# EAGLE design alfred_comm (EAGLE 7.3.0)
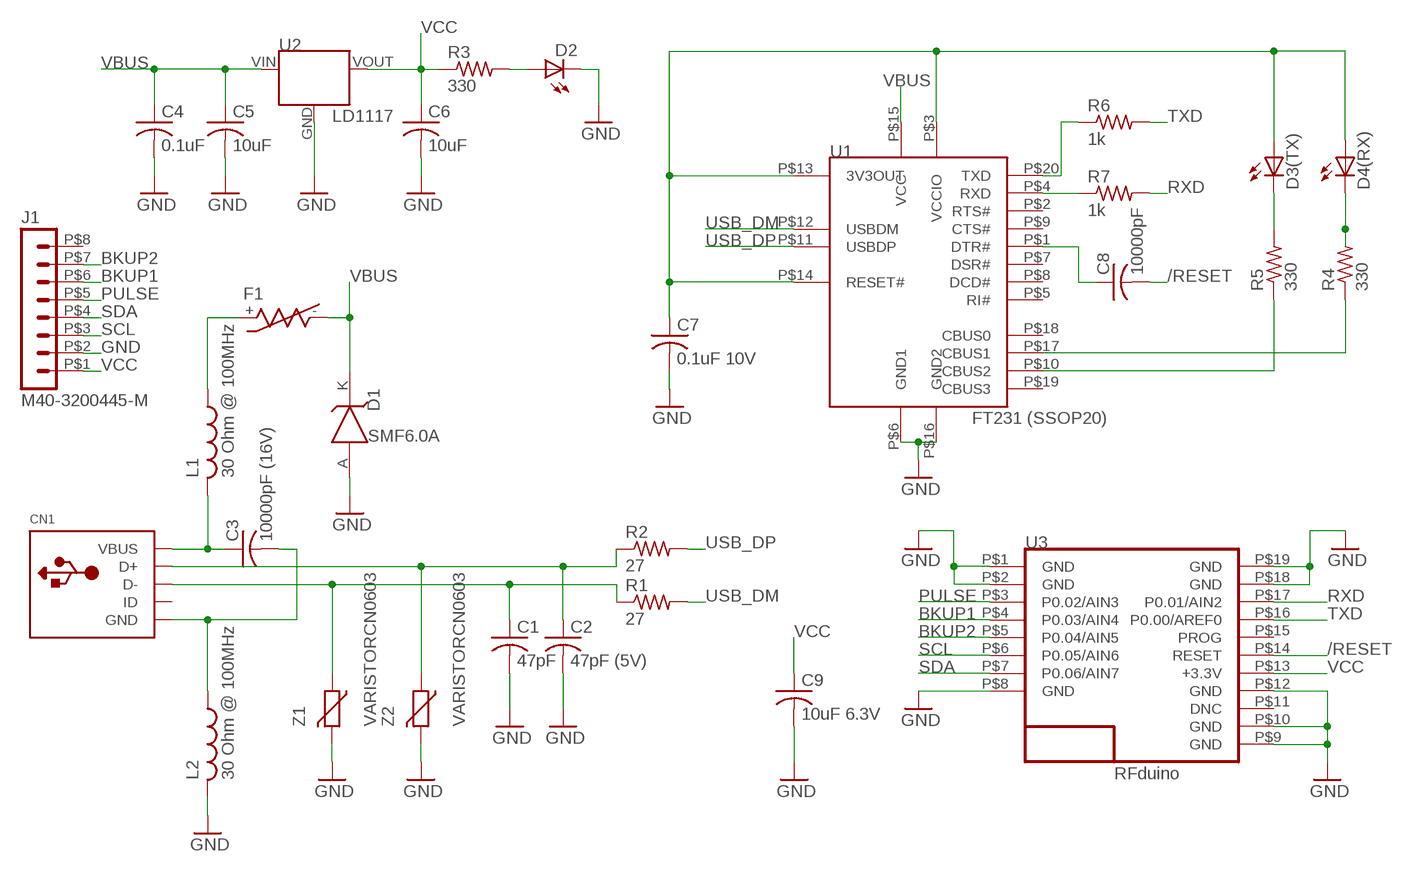
[diagram p0: schematic, sheet 1]

## Parts
C1  47pF  C-USC0603  [C0603]
C2  47pF (5V)  C-USC0603  [C0603]
C3  10000pF (16V)  C-USC0603  [C0603]
C4  0.1uF  C-USC0603  [C0603]
C5  10uF  C-USC0603  [C0603]
C6  10uF  C-USC0603  [C0603]
C7  0.1uF 10V  C-USC0603  [C0603]
C8  10000pF  C-USC0603  [C0603]
C9  10uF 6.3V  C-USC0603  [C0603]
CN1  USBMINIB  [USB-MINIB]
D1  SMF6.0A  [SOD-123F]
D2  LEDCHIPLED_0603  [CHIPLED_0603]
D3(TX)  LEDCHIPLED_0603  [CHIPLED_0603]
D4(RX)  LEDCHIPLED_0603  [CHIPLED_0603]
F1  MF-MSMF050  [BOURNS-STYLE1]
J1  M40-3200445-M  [8-PO-M]
L1  30 Ohm @ 100MHz  L-US0603  [L0603]
L2  30 Ohm @ 100MHz  L-US0603  [L0603]
R1  27  R-US_R0603  [R0603]
R2  27  R-US_R0603  [R0603]
R3  330  R-US_R0603  [R0603]
R4  330  R-US_R0603  [R0603]
R5  330  R-US_R0603  [R0603]
R6  1k  R-US_R0603  [R0603]
R7  1k  R-US_R0603  [R0603]
U1  FT231  [SSOP20]
U2  LD1117-SOT-223  [SOT223]
U3  RFD22301  [RFD21733]
Z1  VARISTORCN0603  [CT/CN0603]
Z2  VARISTORCN0603  [CT/CN0603]

## Nets
/RESET: C8.2 U3.P$14(RESET)
BKUP1: J1.P$6 U3.P$4(P0.03/AIN4)
BKUP2: J1.P$7 U3.P$5(P0.04/AIN5)
GND: C1.2 C2.2 C4.2 C5.2 C6.2 C7.2 C9.2 D1.A D2.C J1.P$2 L2.2 U1.P$6(GND1) U1.P$16(GND2) U2.GND U3.P$1(GND) U3.P$2(GND) U3.P$8(GND) U3.P$9(GND) U3.P$10(GND) U3.P$12(GND) U3.P$18(GND) U3.P$19(GND) Z1.2 Z2.2
N$1: C2.1 CN1.D+ R2.1 Z2.1
N$2: C1.1 CN1.D- R1.1 Z1.1
N$3: C3.1 CN1.VBUS L1.2
N$4: C3.2 CN1.GND L2.1
N$5: F1.+ L1.1
N$6: C7.1 D3(TX).A D4(RX).A U1.P$3(VCCIO) U1.P$13(3V3OUT) U1.P$14(RESET#)
N$7: C8.1 U1.P$1(DTR#)
N$8: R4.1 U1.P$17(CBUS1)
N$9: D3(TX).C R5.2
N$10: D4(RX).C R4.2
N$11: R5.1 U1.P$10(CBUS2)
N$12: R6.1 U1.P$20(TXD)
N$13: R7.1 U1.P$4(RXD)
N$15: D2.A R3.2
PULSE: J1.P$5 U3.P$3(P0.02/AIN3)
RXD: R7.2 U3.P$17(P0.01/AIN2)
SCL: J1.P$3 U3.P$6(P0.05/AIN6)
SDA: J1.P$4 U3.P$7(P0.06/AIN7)
TXD: R6.2 U3.P$16(P0.00/AREF0)
USB_DM: R1.2 U1.P$12(USBDM)
USB_DP: R2.2 U1.P$11(USBDP)
VBUS: C4.1 C5.1 D1.K F1.- U1.P$15(VCC) U2.VIN(IN)
VCC: C6.1 C9.1 J1.P$1 R3.1 U2.VOUT(OUT) U3.P$13(+3.3V)
Unconnected: CN1.ID J1.P$8 U1.P$2(RTS#) U1.P$5(RI#) U1.P$7(DSR#) U1.P$8(DCD#) U1.P$9(CTS#) U1.P$18(CBUS0) U1.P$19(CBUS3) U3.P$11(DNC) U3.P$15(PROG)

## Notes on the sheet
- LD1117
- FT231 (SSOP20)
- SMF6.0A
- RFduino

## Library data of the parts
C1-C9 = rcl:C-US: CAPACITOR, American symbol
CN1 = adafruit:USB: USB Connectors USBMINIB - Surface Mount Female Mini-B USB Connector 4UConnector: 06564 By microbuilder.eu Thru-hole RA Female Mini-B USB Connector 4UConnector: 18732 By ladyada.net
D1 = Zener:SMF6.0A
D2 D3(TX) D4(RX) = adafruit:LED: LED OSRAM: - CHIPLED LG R971, LG N971, LY N971, LG Q971, LY Q971, LO R971, LY R971 LH N974, LH R974 LS Q976, LO Q976, LY Q976 LO Q996 - Hyper CHIPLED LW Q18S LB Q993, LB Q99A, LB R99A - SideLED LS A670, LO A670, LY A670, LG A670, LP A670 LB A673, LV A673, LT A673, LW A673 LH A674 LY A675 LS A676, LA A676, LO A676, LY A676, LW A676 LS A679, LY A679, LG A679 - Hyper Micro SIDELED® LS Y876, LA Y876, LO Y876, LY Y876 LT Y87S - SmartLED LW L88C, LW L88S LB L89C, LB L89S, LG L890 LS L89K, LO L89K, LY L89K LS L896, LA L896, LO L896, LY L896 - TOPLED LS T670, LO T670, LY T670, LG T670, LP T670 LSG T670, LSP T670, LSY T670, LOP T670, LYG T670 LG T671, LOG T671, LSG T671 LB T673, LV T673, LT T673, LW T673 LH T674 LS T676, LA T676, LO T676, LY T676, LB T676, LH T676, LSB T676, LW T676 LB T67C, LV T67C, LT T67C, LS T67K, LO T67K, LY T67K, LW E67C LS E67B, LA E67B, LO E67B, LY E67B, LB E67C, LV E67C, LT E67C LW T67C LS T679, LY T679, LG T679 LS T770, LO T770, LY T770, LG T770, LP T770 LB T773, LV T773, LT T773, LW T773 LH T774 LS E675, LA E675, LY E675, LS T675 LS T776, LA T776, LO T776, LY T776, LB T776 LHGB T686 LT T68C, LB T68C - Hyper Mini TOPLED® LB M676 - Mini TOPLED Santana® LG M470 LS M47K, LO M47K, LY M47K Source: http://www.osram.convergy.de/
F1 = fuse:MF-MSMF050
J1 = board-to-board-conn:M40-3200445-M
L1 L2 = murata-inductors:L-US
R1-R7 = rcl:R-US_: RESISTOR, American symbol
U1 = ftdichip:FT231
U2 = st-microelectronics:LD1117-SOT-223
U3 = RFD22301-11.25.13:RFD22301: RF Digital RFD22301
Z1 Z2 = varistor:VARISTOR: VARISTOR

## Board
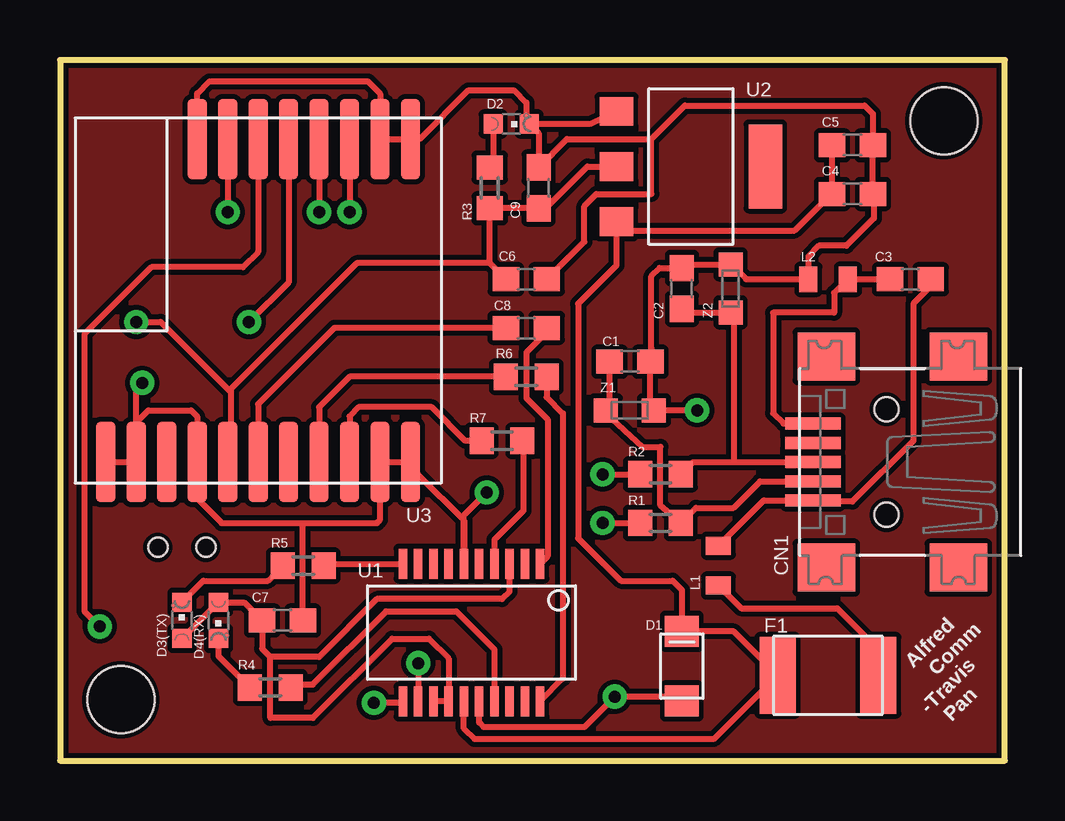
[diagram p1: board, top side]
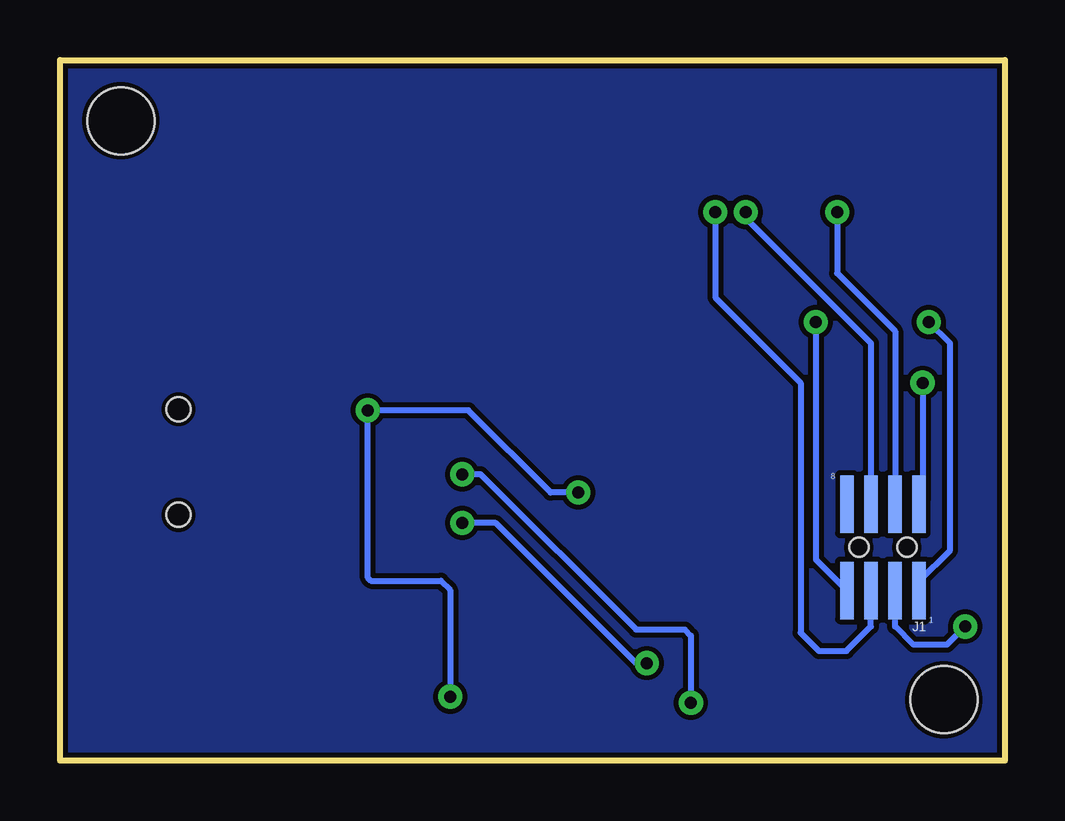
[diagram p2: board, bottom side, seen from below]

Size 39.37 x 29.21 mm. Coordinates in mm from the lower left corner, seen from the top.
Outline: 0,0 39.37,0 39.37,29.21 0,29.21 0,0
Copper layers (1*16): Top 0.035mm / dielectric 1.5mm / Bottom 0.035mm
Design rules "SparkFun": minimum track width 8mil, minimum drill 20mil, track to track 8mil, track to pad 8mil, pad to pad 8mil, via to via 8mil, smd to smd 8mil, copper to edge 8mil, drill to drill 8mil, minimum pad ring 12mil, minimum via ring 10mil, stop-mask expansion 4mil, vias tented up to drill 20mil, thermal gap 10mil
Holes 2.8 mm at 2.54,2.54 36.83,26.67

### Footprints (pad centres in the part's own frame; a part is rotated, then mirrored left to right if it is on the bottom)
C0603 = smd 1.1 x 1: 1 -0.85,0; 2 0.85,0
USB-MINIB = smd 0.5 x 2.308: D+ 0,4.064; D- -0.8,4.064; GND 1.6,4.064; ID 0.8,4.064; VBUS -1.6,4.064 | smd 2 x 2.4: GND1 -4.4,-2; GND2 -4.4,3.5; GND3 4.4,3.5; GND4 4.4,-2 | hole 1: -2.2,1; 2.2,1
SOD-123F = smd 1.3 x 1.4: A 1.45,0; K -1.45,0
CHIPLED_0603 = smd 0.8 x 0.8: A 0,-0.75; C 0,0.75
BOURNS-STYLE1 = smd 1.5 x 3.2: + -2.1,0; - 2.1,0
8-PO-M = smd 0.56 x 2.4: P$1 -1.5,1.8; P$2 -1.5,-1.8; P$3 -0.5,1.8; P$4 -0.5,-1.8; P$5 0.5,1.8; P$6 0.5,-1.8; P$7 1.5,1.8; P$8 1.5,-1.8 | hole 0.8: -1,0; 1,0
L0603 = smd 0.75 x 1.05: 1 -0.825,0; 2 0.825,0
R0603 = smd 1 x 1.1: 1 -0.85,0; 2 0.85,0
SSOP20 = smd 0.36 x 1.25: P$1 -2.857,-2.867; P$2 -2.223,-2.867; P$3 -1.587,-2.867; P$4 -0.953,-2.867; P$5 -0.318,-2.867; P$6 0.318,-2.867; P$7 0.953,-2.867; P$8 1.587,-2.867; P$9 2.223,-2.867; P$10 2.857,-2.867; P$11 2.857,2.867; P$12 2.223,2.867; P$13 1.587,2.867; P$14 0.953,2.867; P$15 0.318,2.867; P$16 -0.318,2.867; P$17 -0.953,2.867; P$18 -1.587,2.867; P$19 -2.223,2.867; P$20 -2.857,2.867
SOT223 = smd 1.2 x 1.4: GND -2.3,-3.1; VIN 2.3,-3.1; VOUT 0,-3.1 | smd 3.5 x 1.4: P$1 0,3.1
RFD21733 = smd 3.353 x 0.813: P$1 -6.731,6.35; P$2 -6.731,5.08; P$3 -6.731,3.81; P$4 -6.731,2.54; P$5 -6.731,1.27; P$6 -6.731,0; P$7 -6.731,-1.27; P$8 -6.731,-2.54; P$9 6.731,-6.35; P$10 6.731,-5.08; P$11 6.731,-3.81; P$12 6.731,-2.54; P$13 6.731,-1.27; P$14 6.731,0; P$15 6.731,1.27; P$16 6.731,2.54; P$17 6.731,3.81; P$18 6.731,5.08; P$19 6.731,6.35
CT/CN0603 = smd 1 x 1: 1 -1,0; 2 1,0

### Placement (x,y rotation side)
C1  23.75,16.64 0 top
C2  25.91,19.68 90 top
C3  35.43,20.07 180 top
C4  33.02,23.62 0 top
C5  33.02,25.65 0 top
C6  19.43,20.07 0 top
C7  9.27,5.84 0 top
C8  19.43,18.03 180 top
C9  19.94,23.88 90 top
CN1  35.43,12.45 90 top
D1  25.91,3.94 270 top
D2  18.8,26.54 270 top
D3(TX)  5.08,5.84 0 top
D4(RX)  6.6,5.84 180 top
F1  32,3.56 180 top
J1  5.08,8.89 180 bottom
L1  27.43,8.13 90 top
L2  32,20.07 180 top
R1  25.02,9.91 180 top
R2  25.02,11.94 180 top
R3  17.91,23.88 90 top
R4  8.76,3.05 180 top
R5  10.13,8.13 180 top
R6  19.43,16 180 top
R7  18.41,13.34 180 top
U1  17.14,5.33 180 top
U2  26.29,24.77 270 top
U3  8.26,19.18 270 top
Z1  23.75,14.61 0 top
Z2  27.94,19.68 90 top

### Tracks (layer width: path | path; a pad name or v marks a point on that pad's centre or on a via)
/RESET
  Top 0.254: C8.2 11.43,18.03 8.26,14.86 U3.P$14
BKUP1  (via drill 0.5)
  Top 0.254: U3.P$4 v10.79,22.86
  Bottom 0.254: v10.79,22.86 10.79,22.61 5.59,17.4 J1.P$6
BKUP2  (via drill 0.5)
  Top 0.254: U3.P$5 9.53,19.94 v7.87,18.29
  Bottom 0.254: v7.87,18.29 7.87,8.38 J1.P$7
GND  (via drill 0.5)
  Top 0.254: v26.54,14.61 Z1.2 24.6,14.76 C1.2 24.64,17.18 24.64,20.19 24.98,20.54 C2.2 26.06,20.68 Z2.2 27.96,20.7 28.59,20.07 L2.2 31.18,21.02 31.62,21.46 32.77,21.46 33.91,22.61 33.91,23.58 C4.2 C5.2 33.87,26.96 33.53,27.3 26.04,27.3 24.64,25.91 | D1.A 25.73,2.67 v23.11,2.67 21.84,1.4 17.65,1.4 17.46,1.59 U1.P$16 | U2.GND 22.07,26.54 D2.C | D2.C 19.94,26.15 C9.2 21.12,25.91 24.64,25.91 | C6.2 21.84,21.63 21.84,23.11 22.35,23.62 24.64,23.62 24.64,25.91 | U3.P$8 5.71,27.81 6.22,28.32 12.83,28.32 13.34,27.81 U3.P$2 U3.P$1 14.99,25.91 17.02,27.94 18.92,27.94 19.43,27.43 19.43,26.66 D2.C | U3.P$9 U3.P$10 | 10.16,9.91 6.73,9.91 5.71,10.92 U3.P$12 5.71,14.35 5.46,14.61 3.68,14.61 3.17,14.1 U3.P$10 | 10.16,9.91 13.21,9.91 13.34,10.03 U3.P$18 U3.P$19 14.61,11.94 14.91,11.94 16.84,10.01 16.84,8.21 U1.P$6 16.83,10.22 v17.78,11.18 | C7.2 10.12,9.87 10.16,9.91 | U3.P$10 3.17,15.49 v3.43,15.75
  Bottom 0.254: v23.11,2.67 23.11,7.11 23.5,7.49 26.42,7.49 26.54,7.62 v26.54,14.61 22.35,14.61 18.92,11.18 v17.78,11.18 | v3.43,15.75 3.43,10.84 J1.P$2
N$1
  Top 0.254: C2.1 26.06,18.68 Z2.1 28.07,18.56 28.07,12.45 | R2.1 26.38,12.45 28.07,12.45 | 28.07,12.45 CN1.D+
N$2
  Top 0.254: C1.1 22.9,14.76 Z1.1 22.75,14.46 24.26,13.08 25.02,13.08 25.02,10.63 R1.1 26.5,10.54 28.07,10.54 29.17,11.65 CN1.D-
N$3
  Top 0.254: L1.2 29.32,10.85 CN1.VBUS 31.42,10.79 33.02,10.79 35.56,13.34 35.56,19.05 36.28,19.77 C3.1
N$4
  Top 0.254: CN1.GND 30.15,14.05 29.72,14.48 29.72,18.67 32.26,18.67 32.26,19.5 L2.1 C3.2
N$5
  Top 0.254: L1.1 28.39,6.35 32.38,6.35 34.1,4.63 F1.+
N$6
  Top 0.254: 8.76,4.32 8.76,1.78 10.54,1.78 13.84,5.08 15.37,5.08 16.19,4.25 U1.P$14 U1.P$13 | 8.76,4.32 10.79,4.32 13.21,6.73 18.41,6.73 18.73,7.05 U1.P$3 | D3(TX).A 5.1,5.09 D4(RX).A 7.67,6.59 C7.1 8.42,4.66 8.76,4.32
N$7
  Top 0.254: C8.1 20.28,17.87 19.43,17.02 19.43,15.11 20.32,14.22 20.32,8.52 U1.P$1
N$8
  Top 0.254: R4.1 9.74,2.92 9.99,3.17 10.54,3.17 13.59,6.22 16.51,6.22 18.1,4.64 U1.P$17
N$9
  Top 0.254: D3(TX).C 5.08,6.6 5.97,7.49 8.68,7.49 R5.2
N$10
  Top 0.254: D4(RX).C 6.6,4.36 R4.2
N$11
  Top 0.254: R5.1 11.08,8.2 U1.P$10
N$12
  Top 0.254: R6.1 20.28,15.15 20.95,14.48 20.95,3.42 U1.P$20
N$13
  Top 0.254: R7.1 19.3,13.3 19.3,10.41 18.1,9.21 U1.P$4
N$14
  pour Top: 0,0 39.37,0 39.37,29.21 0,29.21
N$15
  Top 0.254: D2.A 18.05,24.86 R3.2
N$16
  pour Bottom: 0,0 39.37,0 39.37,29.21 0,29.21
PULSE  (via drill 0.5)
  Top 0.254: U3.P$3 v12.06,22.86
  Bottom 0.254: v12.06,22.86 12.06,19.3 8.51,15.75 8.51,5.33 7.75,4.57 6.6,4.57 5.59,5.59 J1.P$5
RXD
  Top 0.254: R7.2 16.89,13.34 15.49,14.73 12.45,14.73 12.06,14.35 U3.P$17
SCL  (via drill 0.5)
  Top 0.254: U3.P$6 8.26,21.21 7.62,20.57 3.81,20.57 1.02,17.78 1.02,6.22 1.27,5.97 v1.65,5.59
  Bottom 0.254: v1.65,5.59 2.41,4.83 3.81,4.83 4.57,5.59 J1.P$3
SDA  (via drill 0.5)
  Top 0.254: U3.P$7 v6.99,22.86
  Bottom 0.254: v6.99,22.86 6.99,20.32 4.57,17.91 J1.P$4
TXD
  Top 0.254: R6.2 12.06,16 10.79,14.73 U3.P$16
USB_DM  (via drill 0.5)
  Top 0.254: v22.61,9.91 R1.2 | v14.92,4.06 U1.P$12
  Bottom 0.254: v14.92,4.06 15.37,4.06 21.21,9.91 v22.61,9.91
USB_DP  (via drill 0.5)
  Top 0.254: v22.61,11.94 R2.2 | U1.P$11 14.23,2.41 v13.08,2.41
  Bottom 0.254: v13.08,2.41 13.08,5.21 13.34,5.46 15.37,5.46 21.84,11.94 v22.61,11.94
VBUS
  Top 0.254: C4.1 C5.1 | 32,23.62 C4.1 | C4.1 32.13,23.62 30.61,22.1 23.42,22.1 U2.VIN 23.19,20.65 21.59,19.05 21.59,9.27 23.37,7.49 25.53,7.49 25.91,7.11 D1.K 28.07,5.39 F1.- 27.24,0.89 17.27,0.89 16.83,1.33 U1.P$15
VCC  (via drill 0.5)
  Top 0.254: R3.1 C9.1 20.23,23.03 21.97,24.77 U2.VOUT | R3.1 18.07,22.86 | C6.1 17.91,20.74 | 17.91,20.74 R3.1 | 17.91,20.74 12.36,20.74 7.11,15.49 7.11,15.37 | 7.11,15.37 7.11,12.57 U3.P$13 | v3.17,18.29 4.19,18.29 7.11,15.37
  Bottom 0.254: J1.P$1 3.58,7.47 2.29,8.76 2.29,17.4 v3.17,18.29

### Text on the board
tPlace: U2 | F1 | Alfred / Comm | -Travis / Pan